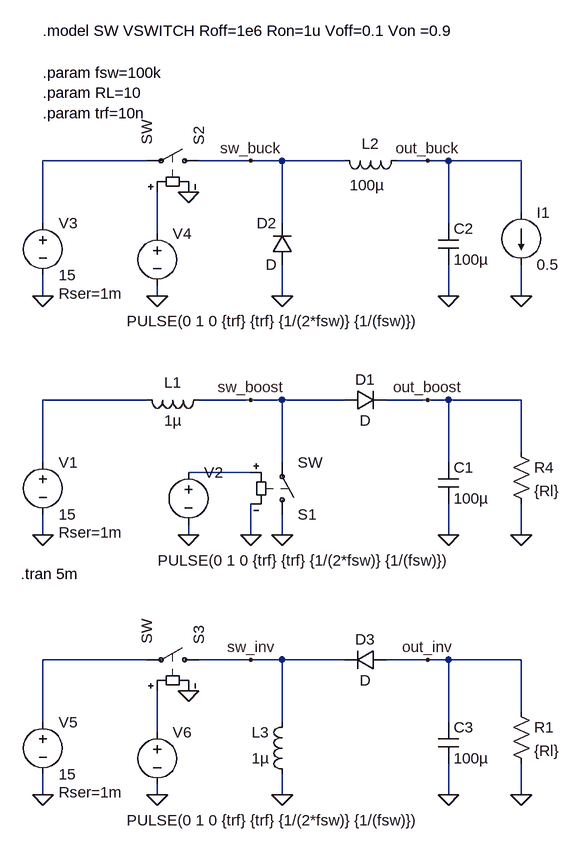
[diagram p0: schematic buckBoostInv.asc]
buckBoostInv.asc, the LTspice schematic file:
Version 4
SHEET 1 1528 1112
WIRE -16 80 -176 80
WIRE 144 80 64 80
WIRE 192 80 144 80
WIRE 288 80 192 80
WIRE 416 80 368 80
WIRE 448 80 416 80
WIRE 560 80 448 80
WIRE 560 160 560 80
WIRE -176 176 -176 80
WIRE 192 176 192 80
WIRE 448 176 448 80
WIRE 0 192 0 128
WIRE -176 288 -176 256
WIRE 0 288 0 272
WIRE 192 288 192 240
WIRE 448 288 448 240
WIRE 560 288 560 240
WIRE -16 448 -176 448
WIRE 144 448 64 448
WIRE 192 448 144 448
WIRE 288 448 192 448
WIRE 416 448 352 448
WIRE 448 448 416 448
WIRE 560 448 448 448
WIRE 560 528 560 448
WIRE -176 544 -176 448
WIRE 192 544 192 448
WIRE 448 544 448 448
WIRE 144 560 48 560
WIRE -176 656 -176 624
WIRE 48 656 48 640
WIRE 144 656 144 608
WIRE 192 656 192 624
WIRE 448 656 448 608
WIRE 560 656 560 608
WIRE -16 848 -176 848
WIRE 144 848 64 848
WIRE 192 848 144 848
WIRE 288 848 192 848
WIRE 416 848 352 848
WIRE 448 848 416 848
WIRE 560 848 448 848
WIRE 560 928 560 848
WIRE -176 944 -176 848
WIRE 192 944 192 848
WIRE 448 944 448 848
WIRE 0 960 0 896
WIRE -176 1056 -176 1024
WIRE 0 1056 0 1040
WIRE 192 1056 192 1024
WIRE 448 1056 448 1008
WIRE 560 1056 560 1008
FLAG 448 656 0
FLAG 192 656 0
FLAG -176 656 0
FLAG 144 656 0
FLAG 48 656 0
FLAG 448 288 0
FLAG 192 288 0
FLAG -176 288 0
FLAG 48 128 0
FLAG 0 288 0
FLAG 416 448 out_boost
FLAG 144 448 sw_boost
FLAG 144 80 sw_buck
FLAG 416 80 out_buck
FLAG 560 288 0
FLAG 560 656 0
FLAG 448 1056 0
FLAG 192 1056 0
FLAG -176 1056 0
FLAG 48 896 0
FLAG 0 1056 0
FLAG 416 848 out_inv
FLAG 144 848 sw_inv
FLAG 560 1056 0
SYMBOL sw 192 640 M180
SYMATTR InstName S1
SYMBOL voltage -176 528 R0
WINDOW 123 0 0 Left 2
WINDOW 39 24 124 Left 2
SYMATTR InstName V1
SYMATTR Value 15
SYMATTR SpiceLine Rser=1m
SYMBOL ind 80 432 R90
WINDOW 0 5 56 VBottom 2
WINDOW 3 32 56 VTop 2
SYMATTR InstName L1
SYMATTR Value 1µ
SYMBOL diode 288 464 R270
WINDOW 0 32 32 VTop 2
WINDOW 3 0 32 VBottom 2
SYMATTR InstName D1
SYMBOL cap 432 544 R0
SYMATTR InstName C1
SYMATTR Value 100µ
SYMBOL voltage 48 544 R0
WINDOW 3 -47 151 Left 2
WINDOW 123 0 0 Left 2
WINDOW 39 0 0 Left 2
SYMATTR InstName V2
SYMATTR Value PULSE(0 1 0 {trf} {trf} {1/(2*fsw)} {1/(fsw)})
SYMBOL sw 80 80 M270
SYMATTR InstName S2
SYMBOL voltage -176 160 R0
WINDOW 123 0 0 Left 2
WINDOW 39 24 124 Left 2
SYMATTR InstName V3
SYMATTR Value 15
SYMATTR SpiceLine Rser=1m
SYMBOL ind 384 64 R90
WINDOW 0 5 56 VBottom 2
WINDOW 3 38 61 VTop 2
SYMATTR InstName L2
SYMATTR Value 100µ
SYMBOL diode 208 240 R180
WINDOW 0 24 64 Left 2
WINDOW 3 24 0 Left 2
SYMATTR InstName D2
SYMBOL cap 432 176 R0
SYMATTR InstName C2
SYMATTR Value 100µ
SYMBOL voltage 0 176 R0
WINDOW 3 -47 151 Left 2
WINDOW 123 0 0 Left 2
WINDOW 39 0 0 Left 2
SYMATTR InstName V4
SYMATTR Value PULSE(0 1 0 {trf} {trf} {1/(2*fsw)} {1/(fsw)})
SYMBOL res 544 512 R0
SYMATTR InstName R4
SYMATTR Value {Rl}
SYMBOL sw 80 848 M270
SYMATTR InstName S3
SYMBOL voltage -176 928 R0
WINDOW 123 0 0 Left 2
WINDOW 39 24 124 Left 2
SYMATTR InstName V5
SYMATTR Value 15
SYMATTR SpiceLine Rser=1m
SYMBOL ind 208 1040 R180
WINDOW 0 36 80 Left 2
WINDOW 3 36 40 Left 2
SYMATTR InstName L3
SYMATTR Value 1µ
SYMBOL diode 352 832 R90
WINDOW 0 0 32 VBottom 2
WINDOW 3 32 32 VTop 2
SYMATTR InstName D3
SYMBOL cap 432 944 R0
SYMATTR InstName C3
SYMATTR Value 100µ
SYMBOL voltage 0 944 R0
WINDOW 3 -47 151 Left 2
WINDOW 123 0 0 Left 2
WINDOW 39 0 0 Left 2
SYMATTR InstName V6
SYMATTR Value PULSE(0 1 0 {trf} {trf} {1/(2*fsw)} {1/(fsw)})
SYMBOL res 544 912 R0
SYMATTR InstName R1
SYMATTR Value {Rl}
SYMBOL current 560 160 R0
WINDOW 123 0 0 Left 2
WINDOW 39 0 0 Left 2
SYMATTR InstName I1
SYMATTR Value 0.5
TEXT -176 -120 Left 2 !.model SW VSWITCH Roff=1e6 Ron=1u Voff=0.1 Von =0.9
TEXT -176 -56 Left 2 !.param fsw=100k\n.param RL=10\n.param trf=10n
TEXT -210 716 Left 2 !.tran 5m

The netlist it stands for:
* buckBoostInv.asc
S1 0 sw_boost N004 0 SW
V1 N003 0 15 Rser=1m
L1 sw_boost N003 1µ
D1 sw_boost out_boost D
C1 out_boost 0 100µ
V2 N004 0 PULSE(0 1 0 {trf} {trf} {1/(2*fsw)} {1/(fsw)})
S2 sw_buck N001 N002 0 SW
V3 N001 0 15 Rser=1m
L2 out_buck sw_buck 100µ
D2 0 sw_buck D
C2 out_buck 0 100µ
V4 N002 0 PULSE(0 1 0 {trf} {trf} {1/(2*fsw)} {1/(fsw)})
R4 out_boost 0 {Rl}
S3 sw_inv N005 N006 0 SW
V5 N005 0 15 Rser=1m
L3 0 sw_inv 1µ
D3 out_inv sw_inv D
C3 out_inv 0 100µ
V6 N006 0 PULSE(0 1 0 {trf} {trf} {1/(2*fsw)} {1/(fsw)})
R1 out_inv 0 {Rl}
I1 out_buck 0 0.5
.model D D
.lib standard.dio
.model SW VSWITCH Roff=1e6 Ron=1u Voff=0.1 Von =0.9
.param fsw=100k
.param RL=10
.param trf=10n
.tran 5m
.backanno
.end